# Altium schematic sheet p2_power_tree.SchDoc
size A4; Organization: ORGANIZATION; Address1: ADDRESS 1; Address2: ADDRESS 2; Address3: ADDRESS 3; Address4: ADDRESS 4; Revision: Rev. A; SheetNumber: 2; SheetTotal: 8; ENG_APP_DATE: --/--/--; DSN_APP_DATE: --/--/--; CHK_APP_DATE: --/--/--
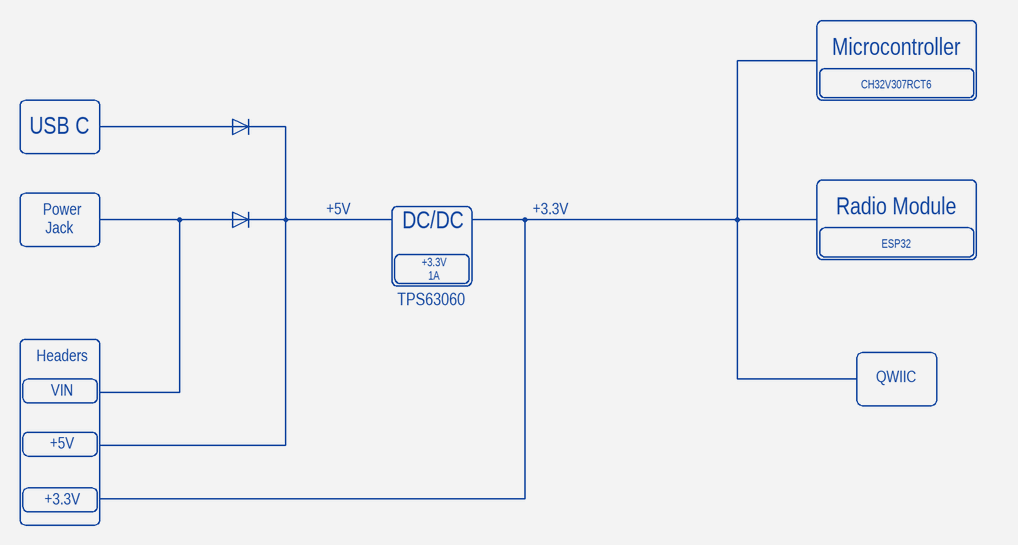
[diagram p0: p2_power_tree.SchDoc]

## Notes on the sheet
- Microcontroller
- USB C
- CH32V307RCT6
- Power
- Radio Module
- Jack
- +5V
- DC/DC
- +3.3V
- 1A
- ESP32
- TPS63060
- Headers
- VIN
- QWIIC
- A4
- GitHub <https://github.com/kirra-cat/druino-uno>
- view on